# EAGLE design LiFePO4wered-USB-3 (EAGLE 7.7.0)
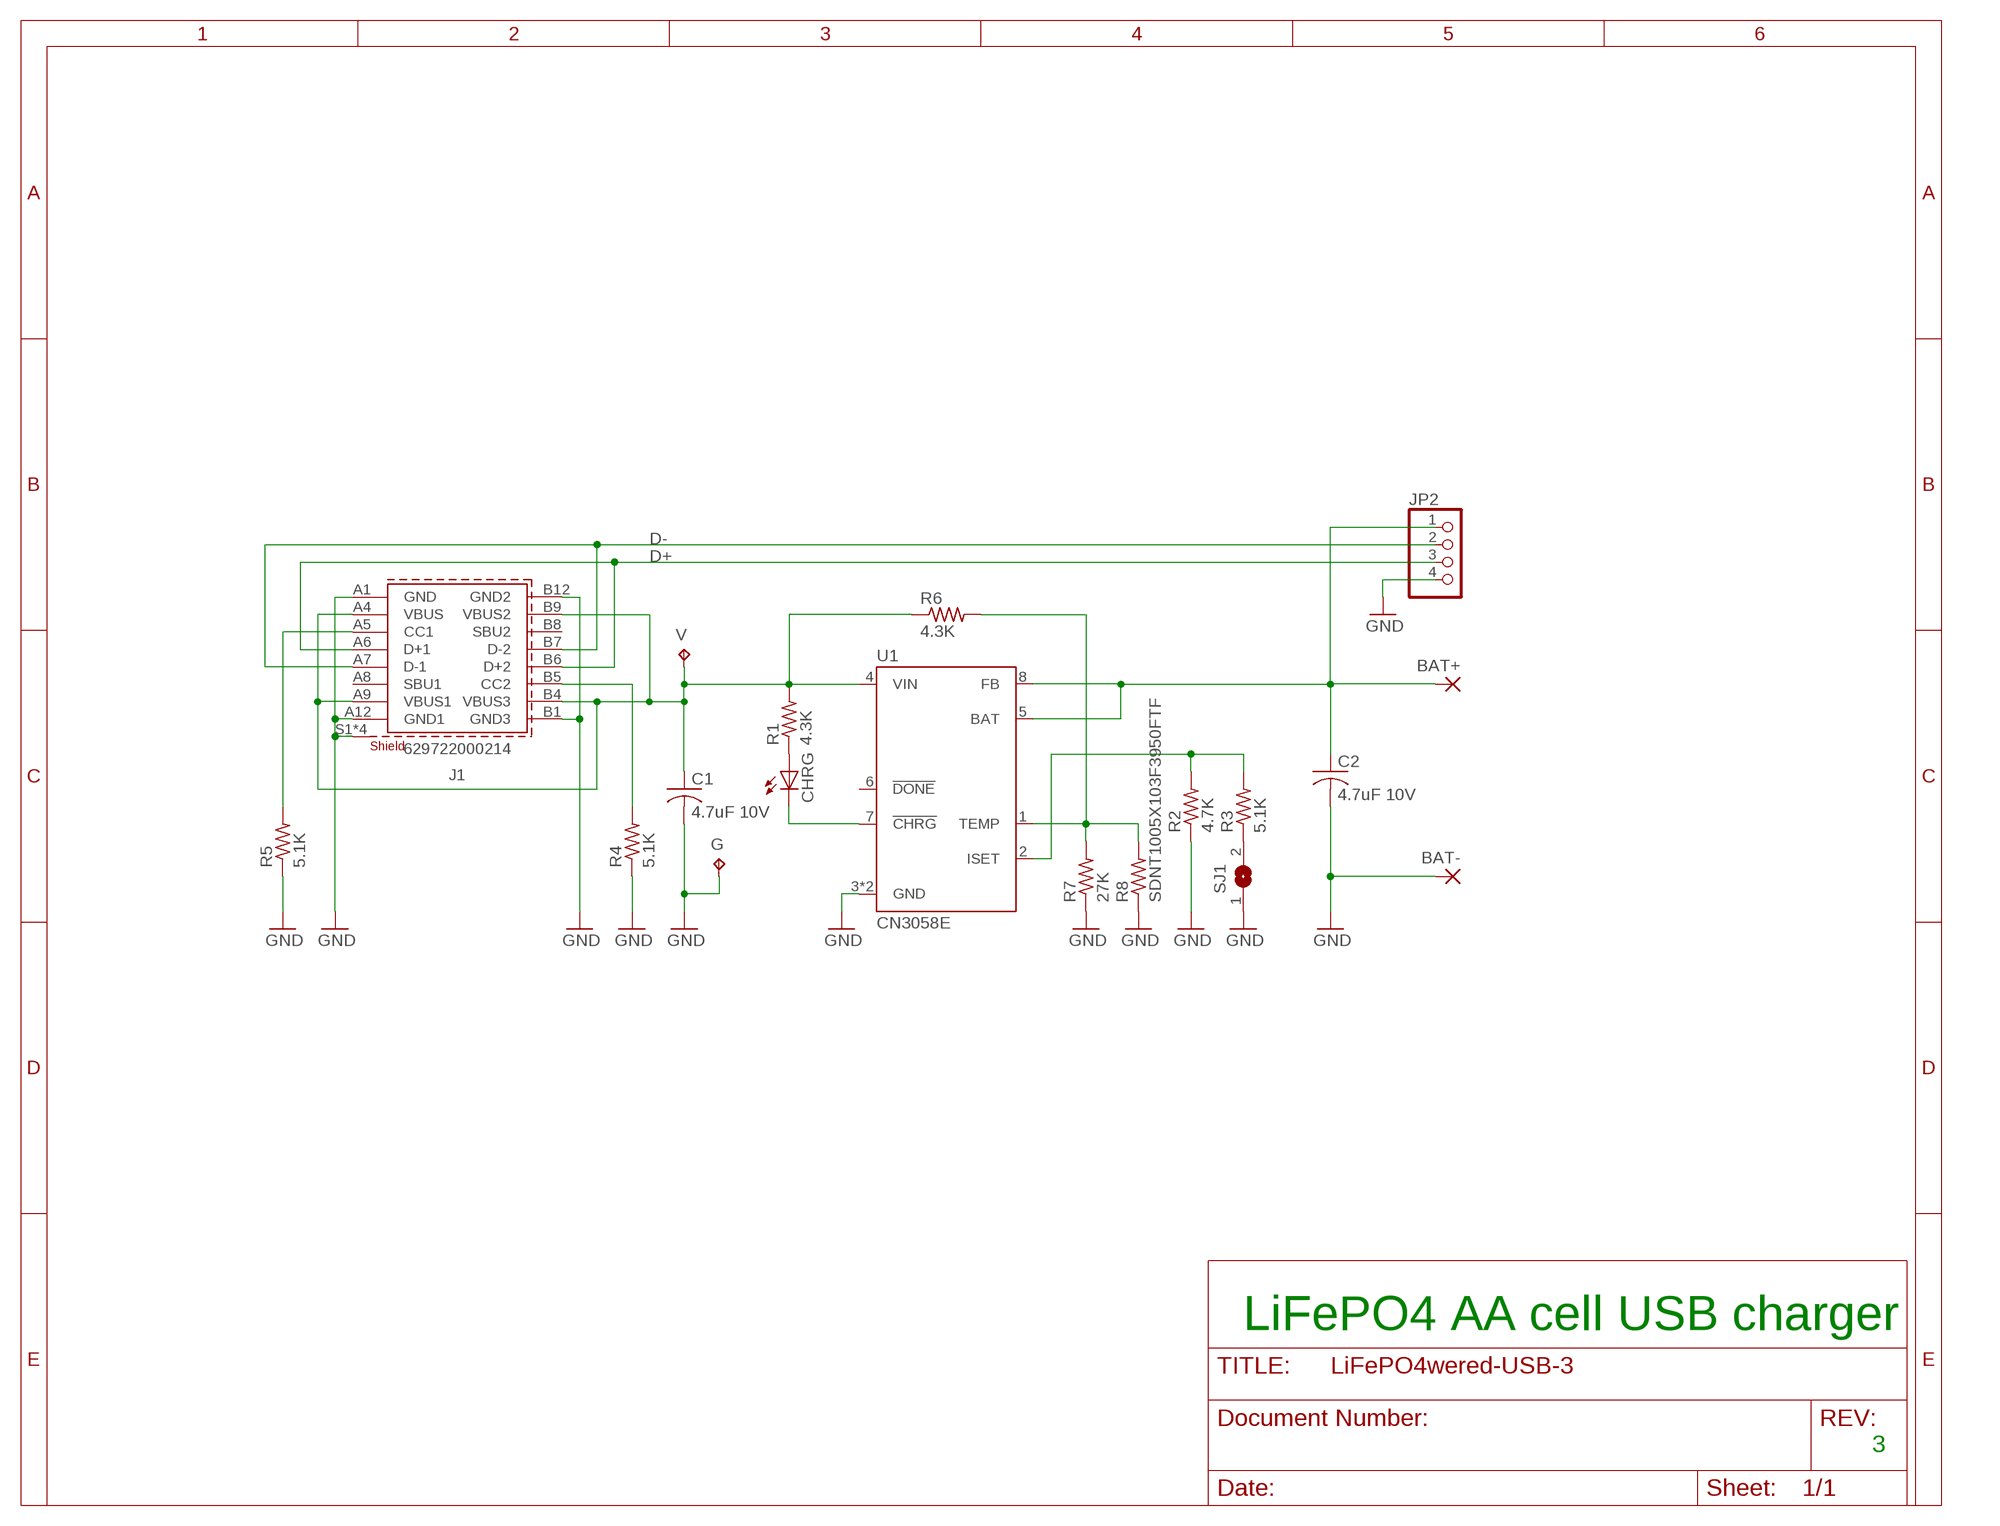
[diagram p0: schematic, sheet 1]

## Parts
BAT+  2,54/1,0  [2,54/1,0]
BAT-  2,54/1,0  [2,54/1,0]
C1  4.7uF 10V  C-USC0603  [C0603]
C2  4.7uF 10V  C-USC0603  [C0603]
CHRG  LEDCHIP-LED0603  [CHIP-LED0603]
G  TPTP20R  [TP20R]
J1  629722000214  [629722000214]
JP2  PINHD-1X4  [1X04]
R1  4.3K  R-US_R0402  [R0402]
R2  4.7K  R-US_R0402  [R0402]
R3  5.1K  R-US_R0402  [R0402]
R4  5.1K  R-US_R0402  [R0402]
R5  5.1K  R-US_R0402  [R0402]
R6  4.3K  R-US_R0402  [R0402]
R7  27K  R-US_R0402  [R0402]
R8  SDNT1005X103F3950FTF  R-US_R0402  [R0402]
SJ1  SJ  [SJ]
U1  CN3058E  [SO08-THERMAL]
V  TPTP20R  [TP20R]

## Nets
D+: J1.A6(D+1) J1.B6(D+2) JP2.3
D-: J1.A7(D-1) J1.B7(D-2) JP2.2
GND: BAT-.1(P) C1.2 C2.2 G.TP J1.A1(GND) J1.A12(GND1) J1.B1(GND3) J1.B12(GND2) J1.S1(SHIELD) J1.S2(SHIELD) J1.S3(SHIELD) J1.S4(SHIELD) JP2.4 R2.1 R4.1 R5.1 R7.1 R8.1 SJ1.1 U1.3(GND) U1.PAD(GND)
N$1: C1.1 J1.A4(VBUS) J1.A9(VBUS1) J1.B4(VBUS3) J1.B9(VBUS2) R1.2 R6.1 U1.4(VIN) V.TP
N$2: CHRG.A R1.1
N$3: CHRG.C U1.7(!CHRG)
N$4: R6.2 R7.2 R8.2 U1.1(TEMP)
N$5: BAT+.1(P) C2.1 JP2.1 U1.5(BAT) U1.8(FB)
N$6: R2.2 R3.2 U1.2(ISET)
N$7: J1.A5(CC1) R5.2
N$9: J1.B5(CC2) R4.2
N$10: R3.1 SJ1.2
Unconnected: J1.A8(SBU1) J1.B8(SBU2) U1.6(!DONE)

## Notes on the sheet
- LiFePO4 AA cell USB charger
- 3

## Library data of the parts
BAT+ BAT- = wirepad:2,54/1,0: THROUGH-HOLE PAD
C1 C2 = rcl:C-US: CAPACITOR, American symbol
CHRG = led:LED: LED OSRAM: - CHIPLED LG R971, LG N971, LY N971, LG Q971, LY Q971, LO R971, LY R971 LH N974, LH R974 LS Q976, LO Q976, LY Q976 LO Q996 - Hyper CHIPLED LW Q18S LB Q993, LB Q99A, LB R99A - SideLED LS A670, LO A670, LY A670, LG A670, LP A670 LB A673, LV A673, LT A673, LW A673 LH A674 LY A675 LS A676, LA A676, LO A676, LY A676, LW A676 LS A679, LY A679, LG A679 - Hyper Micro SIDELED® LS Y876, LA Y876, LO Y876, LY Y876 LT Y87S - SmartLED LW L88C, LW L88S LB L89C, LB L89S, LG L890 LS L89K, LO L89K, LY L89K LS L896, LA L896, LO L896, LY L896 - TOPLED LS T670, LO T670, LY T670, LG T670, LP T670 LSG T670, LSP T670, LSY T670, LOP T670, LYG T670 LG T671, LOG T671, LSG T671 LB T673, LV T673, LT T673, LW T673 LH T674 LS T676, LA T676, LO T676, LY T676, LB T676, LH T676, LSB T676, LW T676 LB T67C, LV T67C, LT T67C, LS T67K, LO T67K, LY T67K, LW E67C LS E67B, LA E67B, LO E67B, LY E67B, LB E67C, LV E67C, LT E67C LW T67C LS T679, LY T679, LG T679 LS T770, LO T770, LY T770, LG T770, LP T770 LB T773, LV T773, LT T773, LW T773 LH T774 LS E675, LA E675, LY E675, LS T675 LS T776, LA T776, LO T776, LY T776, LB T776 LHGB T686 LT T68C, LB T68C - Hyper Mini TOPLED® LB M676 - Mini TOPLED Santana® LG M470 LS M47K, LO M47K, LY M47K Source: http://www.osram.convergy.de LUXEON: - LUMILED® LXK2-PW12-R00, LXK2-PW12-S00, LXK2-PW14-U00, LXK2-PW14-V00 LXK2-PM12-R00, LXK2-PM12-S00, LXK2-PM14-U00 LXK2-PE12-Q00, LXK2-PE12-R00, LXK2-PE12-S00, LXK2-PE14-T00, LXK2-PE14-U00 LXK2-PB12-K00, LXK2-PB12-L00, LXK2-PB12-M00, LXK2-PB14-N00, LXK2-PB14-P00, LXK2-PB14-Q00 LXK2-PR12-L00, LXK2-PR12-M00, LXK2-PR14-Q00, LXK2-PR14-R00 LXK2-PD12-Q00, LXK2-PD12-R00, LXK2-PD12-S00 LXK2-PH12-R00, LXK2-PH12-S00 LXK2-PL12-P00, LXK2-PL12-Q00, LXK2-PL12-R00 Source: www.luxeon.com KINGBRIGHT: KA-3528ASYC Source: www.kingbright.com
G V = testpad:TP: Test pad
J1 = Eagle_WR-USB-rev22c:629722000214: WR-COM USB 2.0 Type C Plug Vertical SMT Kind Properties Durability 10 000 Mating cycles Gender Receptacle Type Horizontal General Information Operating Temperature -40 up to +85 °C Electrical Properties Working Voltage 20 V (DC) Withstanding Voltage 100 V (AC) Contact Resistance 40 mΩ Material Properties Insulator Material LCP Insulator Flammability Rating UL94 V-0 Insulator Color Black Contact Material Brass Contact Plating Gold over Nickel Contact Type Stamped Shielding Material Steel Shielding Plating Nickel (Ni) <https://www.we-online.com/catalog/media/o689297v209%20family-wr-com-629722000214.jpg> Details see: www.we-online.com/catalog/WR-COM_USB_20_TYPE_C_RECEPTACLE_HORIZONTAL_SMT <www.we-online.com/catalog/WR-COM_USB_20_TYPE_C_RECEPTACLE_HORIZONTAL_SMT/?utm_source=eagle_model&utm_medium=description_link&utm_campaign=eisos_eagle> Updated by Ella Wu 2022-11-15 2022 (C) Würth Elektronik; APPLICATION: USB 2.0; DATASHEET-URL: https://www.we-online.com/redexpert/spec/629722000214?ae; GERDER: Receptacle; INTERFACE-TYPE: Type C; IR: 5A; MOUNT: SMT; PACKAGING: Tape and Reel; PART-NUMBER: 629722000214; PINS: 16; TYPE: Horizontal; WORKING-VOLTAGE: 20V(AC)
JP2 = pinhead:PINHD-1X4: PIN HEADER
R1-R8 = resistor:R-US_: RESISTOR, American symbol
SJ1 = jumper:SJ: SMD solder JUMPER
U1 = LiFePO4wered-Tiny:CN3058E: 1A LiFePO4 Battery Charger CN3058E http://consonance-elec.com/pdf/datasheet/DSE-CN3058E.pdf

## Board
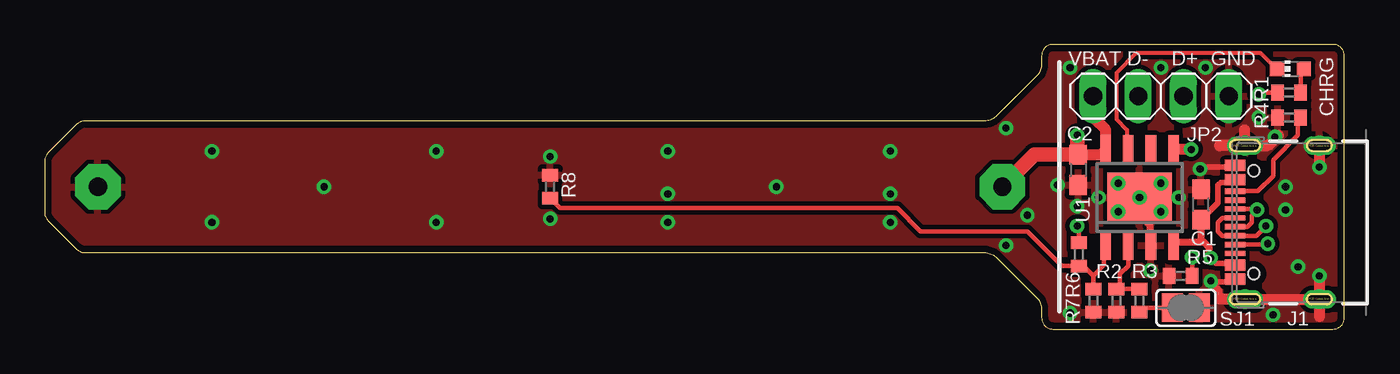
[diagram p1: board, top side]
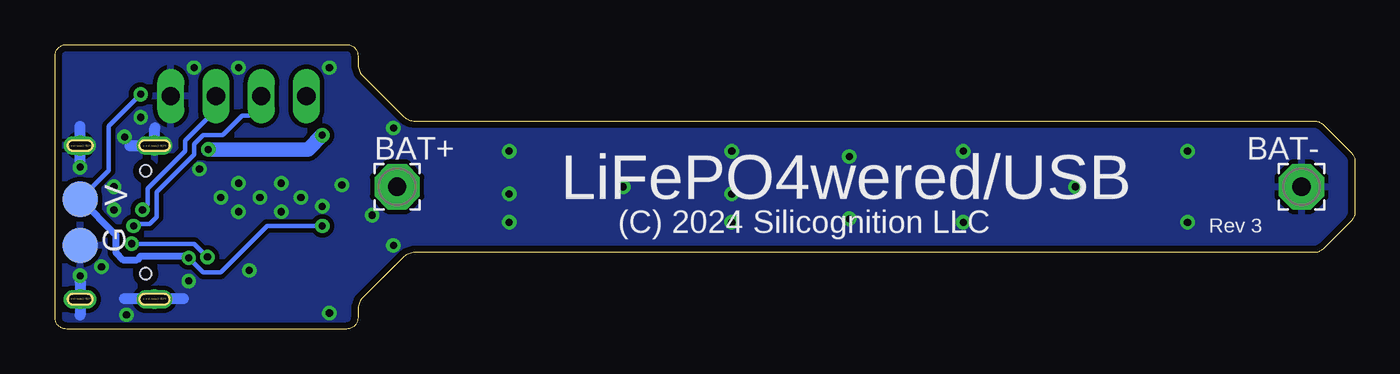
[diagram p2: board, bottom side, seen from below]

Size 73 x 16 mm. Coordinates in mm from the lower left corner, seen from the top.
Outline: 56,15.37 56,14.91 arc-45 55.71,14.21 53.49,11.99 arc-45 52.79,11.7 2.26,11.7 arc45 1.81,11.51 0.19,9.89 arc45 0,9.44 0,6.56 arc45 0.19,6.11 1.81,4.49 arc45 2.26,4.3 52.79,4.3 arc-45 53.49,4.01 55.71,1.79 arc-45 56,1.09 56,0.64 arc90 56.63,0 72.36,0 arc90 73,0.64 73,15.37 arc90 72.36,16 56.63,16 arc90 56,15.37
Copper layers (1*16): Top 0.035mm / dielectric 1.5mm / Bottom 0.035mm
Design rules "default *": minimum track width 6mil, minimum drill 13mil, track to track 6mil, track to pad 6mil, pad to pad 6mil, via to via 6mil, smd to smd 6mil, copper to edge 15mil, drill to drill 8mil, minimum pad ring 10mil, minimum via ring 8mil, stop-mask expansion 4mil, vias tented up to drill 16mil, thermal gap 10mil

### Footprints (pad centres in the part's own frame; a part is rotated, then mirrored left to right if it is on the bottom)
2,54/1,0 = drill 1.016 pad 2.54 octagon: 1 0,0
C0603 = smd 1.1 x 1: 1 -0.85,0; 2 0.85,0
CHIP-LED0603 = smd 0.8 x 0.8: A 0,-0.75; C 0,0.75
TP20R = smd 2 x 2: TP 0,0
629722000214 = smd 0.3 x 1.15: A1 -3.35,4.745; A4 -2.55,4.745; A5 -1.25,4.745; A6 -0.25,4.745; A7 0.25,4.745; A8 1.25,4.745; A9 2.55,4.745; A12 3.35,4.745; B1 3.05,4.745; B4 2.25,4.745; B5 1.75,4.745; B6 0.75,4.745; B7 -0.75,4.745; B8 -1.75,4.745; B9 -2.25,4.745; B12 -3.05,4.745 | drill 0.6 pad 1: S1 -4.32,4.18; S2 4.32,4.18; S3 -4.32,0; S4 4.32,0 | hole 0.65: -2.89,3.68; 2.89,3.68
1X04 = drill 1.016 long: 1 -3.81,0; 2 -1.27,0; 3 1.27,0; 4 3.81,0
R0402 = smd 0.7 x 0.9: 1 -0.65,0; 2 0.65,0
SJ = smd 1.168 x 1.6: 1 -0.762,0; 2 0.762,0
SO08-THERMAL = smd 0.6 x 1.6: 1 -1.905,-2.7; 2 -0.635,-2.7; 3 0.635,-2.7; 4 1.905,-2.7; 5 1.905,2.7; 6 0.635,2.7; 7 -0.635,2.7; 8 -1.905,2.7 | smd 3.6 x 2.8: PAD 0,0

### Placement (x,y rotation side)
BAT+  53.8,8 0 bottom
BAT-  3,8 0 bottom
C1  64.95,7.01 90 top
C2  58.05,8.95 270 top
CHRG  69.97,14.63 90 top
G  71.6,4.7 270 bottom
J1  71.6,6 90 top
JP2  62.7,13.1 0 top
R1  69.9,13.3 180 top
R2  60.2,1.6 90 top
R3  61.5,1.6 90 top
R4  69.9,11.9 0 top
R5  63.8,3 0 top
R6  58.1,4.2 270 top
R7  58.9,1.6 90 top
R8  28.4,8 270 top
SJ1  64.1,1.2 180 top
U1  61.5,7.4 0 top
V  71.6,7.3 90 bottom

### Tracks (layer width: path | path; a pad name or v marks a point on that pad's centre or on a via)
D+  (via drill 0.4)
  Top 0.254: J1.A6 67.55,5.75 67.8,6 67.8,6.4 v68.1,6.7 68.05,6.75 J1.B6
  Bottom 0.254: v68.1,6.7 67.8,7 67.8,7.9 65.7,10 65.7,10.6 64.3,12 64.3,12.77 JP2.3
D-  (via drill 0.4)
  Top 0.254: 61.43,13.07 JP2.2 | J1.A7 66.15,6.25 65.9,6 65.9,5.5 66.15,5.25 J1.B7 68.05,5.25 v68.6,5.8
  Bottom 0.254: JP2.2 61.8,12.73 61.8,12.3 62.1,12 62.5,12 63.6,10.9 64.7,10.9 65.2,10.4 65.2,9.8 67.3,7.7 67.3,6.3 67.7,5.9 68.5,5.9 v68.6,5.8
GND  (via drill 0.4, 0.6)  (1 unrouted)
  Top 0.254: 67.5,10.3 67.7,10.3 | 67.7,10.3 v67.72,10.32 | 67.24,10.3 67.14,10.3 v67.12,10.32 | 67.7,10.3 67.8,10.3 v67.82,10.32
  Top 0.305: J1.A1 65.5,2.65 | 65.5,2.65 v65.5,2.7 | J1.A12 66.75,9.35 66.5,9.1 65,9.1 v64.9,9 | 65.5,2.65 66,2.15 66,1.68
  Top 0.406: 62.1,5.1 62.1,5.8 61.7,6.2
  Top 0.61: J1.S3 J1.S1 66,1.68 66.1,1.7 | 66,10.3 66,10.32 v66.92,10.32 v67.02,10.32 v67.12,10.32 v67.22,10.32 | 69.3,10.9 68.72,10.32 v67.92,10.32 v67.82,10.32 v67.72,10.32 v67.62,10.32 v67.52,10.32 | J1.S4 71.6,9.2 | v67.22,10.32 v67.32,10.32 J1.S2 v67.52,10.32 | v71.22,10.32 v71.32,10.32 v71.42,10.32 v71.52,10.32 J1.S4 | J1.S4 v71.62,10.32 v71.82,10.32 v71.92,10.32 v72.02,10.32 | 67.4,10.3 67.4,11.2 | 71.6,2.9 71.6,0.7 | 67.4,10.3 67.24,10.3 v67.22,10.32 | 67.4,10.3 67.5,10.3 v67.52,10.32
  Bottom 0.61: 71.6,2.7 71.6,0.8 | 71.6,9.3 71.6,11.4 | 65.8,1.7 69.1,1.7 | 67.4,11.3 67.4,10.3 68.8,10.3
  other vias: 62.7,14.7 65.2,14.7 57.6,14.7 57.6,0.9 15.7,8 28.4,9.7 41.1,8 9.4,10 9.4,6 22,10 22,6 35,10 35,6 47.5,10 47.5,6 54,4.7 54,11.3 69,0.8 62.7,8.2 60.3,8.2 60.3,6.6 62.7,6.6 61.5,7.4 59.2,7.4 63.7,7.4 56.9,8.1 58,6.9 62.1,3.3 71.6,3 70.4,3.5 68.2,11.9 69.1,10.8 69.7,8 69.7,6.7 35,7.6 47.5,7.6 55.2,6.4 71.6,9.1 28.4,6.2 67.42,10.32
  pour Bottom (isolate 0.254): 0.2,11.5 52.2,11.5 56.5,15.8 72.8,15.8 72.8,0.2 56.5,0.2 52.2,4.5 0.2,4.5
  pour Top (isolate 0.254): 0.2,4.5 52.2,4.5 56.5,0.2 72.8,0.2 72.8,15.8 56.5,15.8 52.2,11.5 0.2,11.5
GND1  (via drill 0.6)
  Top 0.61: v66.92,1.68 v67.02,1.68 v67.12,1.68 v67.22,1.68 v67.32,1.68 v67.42,1.68 v67.52,1.68 v67.62,1.68 v67.72,1.68 v67.82,1.68 v67.92,1.68
GND2  (via drill 0.6)
  Top 0.61: v71.21,1.68 v71.31,1.68 v71.41,1.68 v71.51,1.68 v71.61,1.68 v71.81,1.68 v71.91,1.68 v72.01,1.68
N$1  (via drill 0.4)
  Top 0.254: R1.2 68.3,13.3 v68.2,13.2 | R6.1 58.1,5.7 v58,5.8 | 66.81,3.7 66.86,3.65 J1.A4 | J1.B4 J1.A9
  Top 0.305: J1.B4 66.05,8.25 65.9,8.1 65.9,7.1 65.3,6.5 65.29,6.5 C1.1 64.95,6.45 65.3,6.1 65.1,5.9 | J1.B9 66.81,3.7 65.8,3.7 v65.5,4 | 63.6,4.9 U1.4
  Top 0.406: 63.6,4.9 64.9,4.9 | 64.9,4.9 65.1,4.9 65.4,4.6 65.4,4.1 v65.5,4 | C1.1 64.95,4.95 64.9,4.9
  Bottom 0.254: v68.2,13.2 70,11.4 70,8.9 V.TP | v58,5.8 61.1,5.8 63.7,3.2 64.7,3.2 v65.5,4
  Bottom 0.406: V.TP 69.6,5.3 69.6,4.3 69.2,3.9 68.4,3.9 68.2,4.1 65.6,4.1 v65.5,4
N$2
  Top 0.254: R1.1 70.55,14.46 CHRG.A
N$3
  Top 0.22: 69.17,14.63 68.3,15.5 61.3,15.5 60.2,14.4 60.2,11.8 60.8,11.2 60.8,10.16
  Top 0.254: CHRG.C 69.17,14.63 | 60.8,10.16 U1.7
N$4
  Top 0.254: R7.2 58.9,3 | 58.9,3 59.5,3.6 59.5,4.61 U1.1 | 58.9,3 58.35,3.55 R6.2 57.15,3.55 55.2,5.5 49.2,5.5 47.9,6.8 28.95,6.8 R8.2
N$5  (via drill 0.4)
  Top 0.61: JP2.1 59,12.99 59,11.8 59.59,11.21 U1.8 59.3,9.8 C2.1 | v64.4,10.1 U1.5
  Top 0.813: C2.1 58,9.8 | 58,9.8 55.6,9.8 BAT+.1 | v58,10.9 58,9.8
  Bottom 0.813: v64.4,10.1 58.8,10.1 v58,10.9
N$6
  Top 0.254: R3.2 R2.2 60.4,2.45 60.4,3.1 60.87,3.56 U1.2
N$7  (via drill 0.4)
  Top 0.254: R5.2 v64.45,4.05 | J1.A5 68.55,4.75 v68.7,4.8
  Bottom 0.254: v68.7,4.8 65.2,4.8 v64.45,4.05
N$9
  Top 0.254: J1.B5 68.15,7.75 69,8.6 69,9.5 70.4,10.9 70.4,11.75 R4.2
N$10
  Top 0.254: R3.1 61.75,1.2 SJ1.2

### Text on the board
tPlace: VBAT | D- | D+ | GND
bPlace: LiFePO4wered/USB | Rev 3 | (C) 2024 Silicognition LLC